# EAGLE schematic communication_module_new_3v3 (EAGLE 9.4.0)
AUTHOR: iPAS
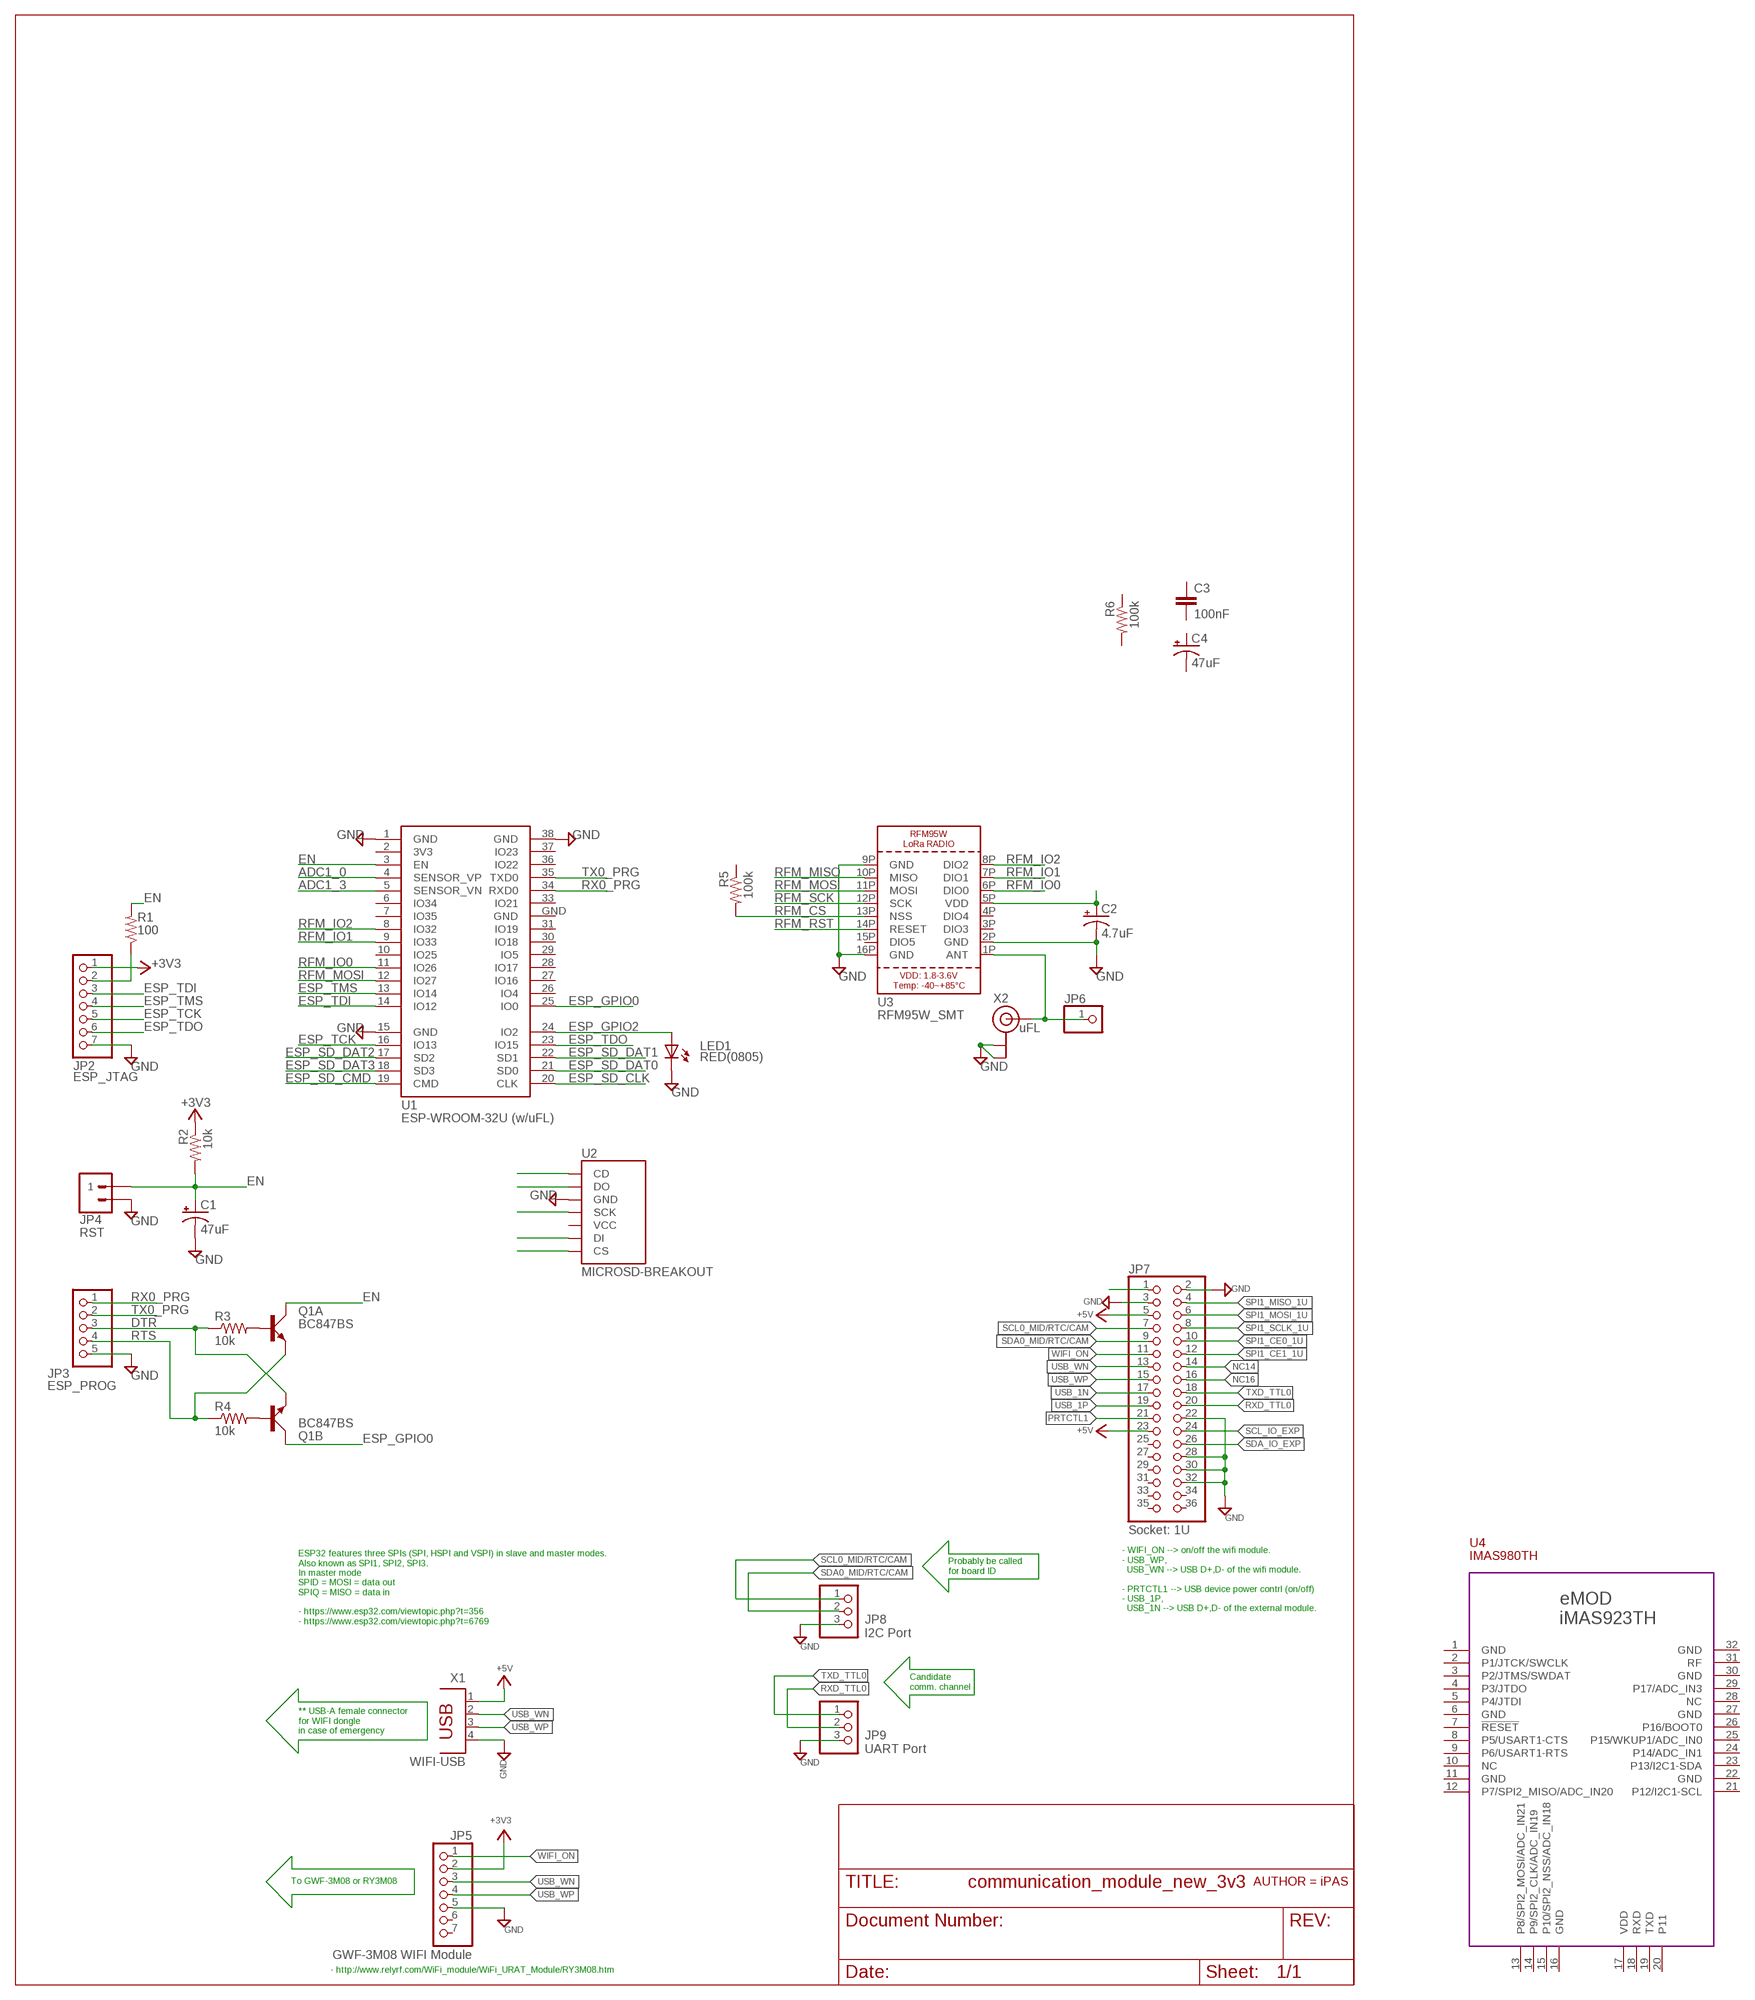
[diagram p0: schematic, sheet 1]
FRAME2 (DINA4_L): AUTHOR: iPAS

## Parts
C1  47uF  RCL_CPOL-US150CLZ-1014  [RCL_150CLZ-1014]
C2  4.7uF  RCL_CPOL-US150CLZ-1014  [RCL_150CLZ-1014]
C3  100nF  RCL_C-EUC1206  [RCL_C1206]
C4  47uF  RCL_CPOL-US150CLZ-1014  [RCL_150CLZ-1014]
JP2  ESP_JTAG  PINHD-1X7  [1X07]
JP3  ESP_PROG  PINHD-1X5  [1X05]
JP4  RST  M02PTH  [1X02]
JP5  GWF-3M08 WIFI Module  PINHD-1X7  [1X07]
JP6  HEADER-1X1ROUND  [1X01_ROUND]
JP7  Socket: 1U  PINHD-2X18  [2X18]
JP8  I2C Port  PINHD-1X3  [1X03]
JP9  UART Port  PINHD-1X3  [1X03]
LED1  RED(0805)  LEDCHIP-LED0805  [CHIP-LED0805]
Q1  BC847BS  [SOT363_PHILIPS]
R1  100  RCL_R-USM0805  [RCL_M0805]
R2  10k  RCL_R-USM0805  [RCL_M0805]
R3  10k  RCL_R-USM0805  [RCL_M0805]
R4  10k  RCL_R-USM0805  [RCL_M0805]
R5  100k  RCL_R-USM0805  [RCL_M0805]
R6  100k  RCL_R-USM0805  [RCL_M0805]
U1  ESP-WROOM-32U (w/uFL)  ESP-WROOM-32  [ESP-WROOM-32]
U2  MICROSD-BREAKOUT  [MICROSD-BREAKOUT]
U3  RFM95W_SMT  [RFMHCW_SMT]
U4  IMAS980TH  [IMAS923TH]
X1  WIFI-USB  PN87520  [PN87520]
X2  uFL  ANTENNA_U.FL  [U.FL]

## Nets
+3V3: JP2.1 JP5.2 R2.1
+5V: JP7.5 JP7.23 X1.1
ADC1_0: U1.4(SENSOR_VP)
ADC1_3: U1.5(SENSOR_VN)
ANT: JP6.1 U3.1P(ANT) X2.3(SIGNAL)
DTR: JP3.3 Q1.4(B:E) R3.1
EN: C1.+ JP4.1 Q1.6(A:C) R1.2 R2.2 U1.3(EN)
ESP_GPIO0: Q1.3(B:C) U1.25(IO0)
ESP_GPIO2: LED1.A U1.24(IO2)
ESP_SD_CLK: U1.20(CLK)
ESP_SD_CMD: U1.19(CMD)
ESP_SD_DAT0: U1.21(SD0)
ESP_SD_DAT1: U1.22(SD1)
ESP_SD_DAT2: U1.17(SD2)
ESP_SD_DAT3: U1.18(SD3)
ESP_TCK: JP2.5 U1.16(IO13)
ESP_TDI: JP2.3 U1.14(IO12)
ESP_TDO: JP2.6 U1.23(IO15)
ESP_TMS: JP2.4 U1.13(IO14)
GND: C1.- C2.- JP2.7 JP3.5 JP4.2 JP5.5 JP7.2 JP7.3 JP7.22 JP7.28 JP7.30 JP7.32 JP8.3 JP9.3 LED1.C U1.1(GND) U1.15(GND) U1.38(GND) U2.GND U3.2P(GND) U3.9P(GND) U3.16P(GND) X1.4 X2.1(GND) X2.2(GND)
N$1: U2.CD
N$2: C2.+ U3.5P(VDD)
N$3: U2.DO
N$4: U2.SCK
N$5: U2.DI
N$6: U2.CS
N$7: JP7.1
N$13: Q1.2(A:B) R3.2
N$14: Q1.5(B:B) R4.2
N$16: JP2.2 R1.1
NC14: JP7.14
NC16: JP7.16
PRTCTL1: JP7.21
RFM_CS: R5.2 U3.13P(NSS)
RFM_IO0: U1.11(IO26) U3.6P(DIO0)
RFM_IO1: U1.9(IO33) U3.7P(DIO1)
RFM_IO2: U1.8(IO32) U3.8P(DIO2)
RFM_MISO: U3.10P(MISO)
RFM_MOSI: U1.12(IO27) U3.11P(MOSI)
RFM_RST: U3.14P(RESET)
RFM_SCK: U3.12P(SCK)
RTS: JP3.4 Q1.1(A:E) R4.1
RX0_PRG: JP3.1 U1.34(RXD0)
RXD_TTL0: JP7.20 JP9.2
SCL0_MID/RTC/CAM: JP7.7 JP8.1
SCL_IO_EXP: JP7.24
SDA0_MID/RTC/CAM: JP7.9 JP8.2
SDA_IO_EXP: JP7.26
SPI1_CE0_1U: JP7.10
SPI1_CE1_1U: JP7.12
SPI1_MISO_1U: JP7.4
SPI1_MOSI_1U: JP7.6
SPI1_SCLK_1U: JP7.8
TX0_PRG: JP3.2 U1.35(TXD0)
TXD_TTL0: JP7.18 JP9.1
USB_1N: JP7.17
USB_1P: JP7.19
USB_WN: JP5.3 JP7.13 X1.2
USB_WP: JP5.4 JP7.15 X1.3
WIFI_ON: JP5.1 JP7.11
Unconnected: C3.1 C3.2 C4.+ C4.- JP5.6 JP5.7 JP7.25 JP7.27 JP7.29 JP7.31 JP7.33 JP7.34 JP7.35 JP7.36 R5.1 R6.1 R6.2 U1.6(IO34) U1.7(IO35) U1.10(IO25) U1.26(IO4) U1.27(IO16) U1.28(IO17) U1.29(IO5) U1.30(IO18) U1.31(IO19) U1.33(IO21) U1.36(IO22) U1.37(IO23) U2.VCC U3.3P(DIO3) U3.4P(DIO4) U3.15P(DIO5) U4.2(P1/JTCK/SWCLK) U4.3(P2/JTMS/SWDAT) U4.4(P3/JTDO) U4.5(P4/JTDI) U4.7(!RESET) U4.8(P5/USART1-CTS) U4.9(P6/USART1-RTS) U4.10(NC) U4.12(P7/SPI2_MISO/ADC_IN20) U4.13(P8/SPI2_MOSI/ADC_IN21) U4.14(P9/SPI2_CLK/ADC_IN19) U4.15(P10/SPI2_NSS/ADC_IN18) U4.18(RXD) U4.19(TXD) U4.20(P11) U4.21(P12/I2C1-SCL) U4.23(P13/I2C1-SDA) U4.24(P14/ADC_IN1) U4.25(P15/WKUP1/ADC_IN0) U4.26(P16/BOOT0) U4.28(NC) U4.29(P17/ADC_IN3) U4.31(RF)

## Notes on the sheet
- Probably be called
  for board ID
- - WIFI_ON --> on/off the wifi module.
  - USB_WP, 
    USB_WN --> USB D+,D- of the wifi module.
  
  - PRTCTL1 --> USB device power contrl (on/off)
  - USB_1P, 
    USB_1N --> USB D+,D- of the external module.
- ESP32 features three SPIs (SPI, HSPI and VSPI) in slave and master modes. 
  Also known as SPI1, SPI2, SPI3.
  In master mode 
  SPID = MOSI = data out
  SPIQ = MISO = data in
  
  - https://www.esp32.com/viewtopic.php?t=356
  - https://www.esp32.com/viewtopic.php?t=6769
- Candidate 
  comm. channel
- ** USB-A female connector
  for WIFI dongle
  in case of emergency
- To GWF-3M08 or RY3M08
- - http://www.relyrf.com/WiFi_module/WiFi_URAT_Module/RY3M08.htm

## Power pins joined to a net without a drawn wire
3V3: U1.2(3V3)
GND: U1.GND U4.1(GND) U4.6(GND) U4.11(GND) U4.16(GND) U4.22(GND) U4.27(GND) U4.30(GND) U4.32(GND)
VDD: U4.17(VDD)

## Library data of the parts
C1 C2 C4 = ipas:RCL_CPOL-US: POLARIZED CAPACITOR, American symbol
C3 = ipas:RCL_C-EU: CAPACITOR, European symbol
JP2 JP5 = pinhead:PINHD-1X7: PIN HEADER
JP3 = pinhead:PINHD-1X5: PIN HEADER
JP4 = ipas:M02: Header 2 Standard 2-pin 0.1" header. Use with straight break away headers (SKU : PRT-00116), right angle break away headers (PRT-00553), swiss pins (PRT-00743), machine pins (PRT-00117), and female headers (PRT-00115). Molex polarized connector foot print use with SKU : PRT-08233 with associated crimp pins and housings.
JP6 = microbuilder:HEADER-1X1: PIN HEADER
JP7 = pinhead:PINHD-2X18: PIN HEADER
JP8 JP9 = pinhead:PINHD-1X3: PIN HEADER
LED1 = led:LED: LED OSRAM: - CHIPLED LG R971, LG N971, LY N971, LG Q971, LY Q971, LO R971, LY R971 LH N974, LH R974 LS Q976, LO Q976, LY Q976 LO Q996 - Hyper CHIPLED LW Q18S LB Q993, LB Q99A, LB R99A - SideLED LS A670, LO A670, LY A670, LG A670, LP A670 LB A673, LV A673, LT A673, LW A673 LH A674 LY A675 LS A676, LA A676, LO A676, LY A676, LW A676 LS A679, LY A679, LG A679 - Hyper Micro SIDELED® LS Y876, LA Y876, LO Y876, LY Y876 LT Y87S - SmartLED LW L88C, LW L88S LB L89C, LB L89S, LG L890 LS L89K, LO L89K, LY L89K LS L896, LA L896, LO L896, LY L896 - TOPLED LS T670, LO T670, LY T670, LG T670, LP T670 LSG T670, LSP T670, LSY T670, LOP T670, LYG T670 LG T671, LOG T671, LSG T671 LB T673, LV T673, LT T673, LW T673 LH T674 LS T676, LA T676, LO T676, LY T676, LB T676, LH T676, LSB T676, LW T676 LB T67C, LV T67C, LT T67C, LS T67K, LO T67K, LY T67K, LW E67C LS E67B, LA E67B, LO E67B, LY E67B, LB E67C, LV E67C, LT E67C LW T67C LS T679, LY T679, LG T679 LS T770, LO T770, LY T770, LG T770, LP T770 LB T773, LV T773, LT T773, LW T773 LH T774 LS E675, LA E675, LY E675, LS T675 LS T776, LA T776, LO T776, LY T776, LB T776 LHGB T686 LT T68C, LB T68C - Hyper Mini TOPLED® LB M676 - Mini TOPLED Santana® LG M470 LS M47K, LO M47K, LY M47K Source: http://www.osram.convergy.de LUXEON: - LUMILED® LXK2-PW12-R00, LXK2-PW12-S00, LXK2-PW14-U00, LXK2-PW14-V00 LXK2-PM12-R00, LXK2-PM12-S00, LXK2-PM14-U00 LXK2-PE12-Q00, LXK2-PE12-R00, LXK2-PE12-S00, LXK2-PE14-T00, LXK2-PE14-U00 LXK2-PB12-K00, LXK2-PB12-L00, LXK2-PB12-M00, LXK2-PB14-N00, LXK2-PB14-P00, LXK2-PB14-Q00 LXK2-PR12-L00, LXK2-PR12-M00, LXK2-PR14-Q00, LXK2-PR14-R00 LXK2-PD12-Q00, LXK2-PD12-R00, LXK2-PD12-S00 LXK2-PH12-R00, LXK2-PH12-S00 LXK2-PL12-P00, LXK2-PL12-Q00, LXK2-PL12-R00 Source: www.luxeon.com KINGBRIGHT: KA-3528ASYC Source: www.kingbright.com
Q1 = transistor-small-signal:BC847BS: NPN general purpose double transistor Source: http://www.farnell.com/datasheets/2466.pdf
R1-R6 = ipas:RCL_R-US: RESISTOR, American symbol
U1 = esp32:ESP-WROOM-32: Espressif Systems ESP-WROOM-32
U2 = SparkFun-Boards:MICROSD-BREAKOUT
U3 = ipas:RFM95W: RFM69HCW - ISM Band RF Transceiver
U4 = IMAS923TH:IMAS980TH: eMOD iMAS923TH EmOne (Thailand) Co.,Ltd. 39/1 Soi. Sangkhom Songkhro 12 Lat Phrao, Bangkok 10230 Thailand Eable library Created by EmOne @ 2018
X1 = con-berg:PN87520: BERG USB connector; OC_FARNELL: unknown; OC_NEWARK: unknown
X2 = microbuilder:ANTENNA_U.FL: U.FL Antenna Connector